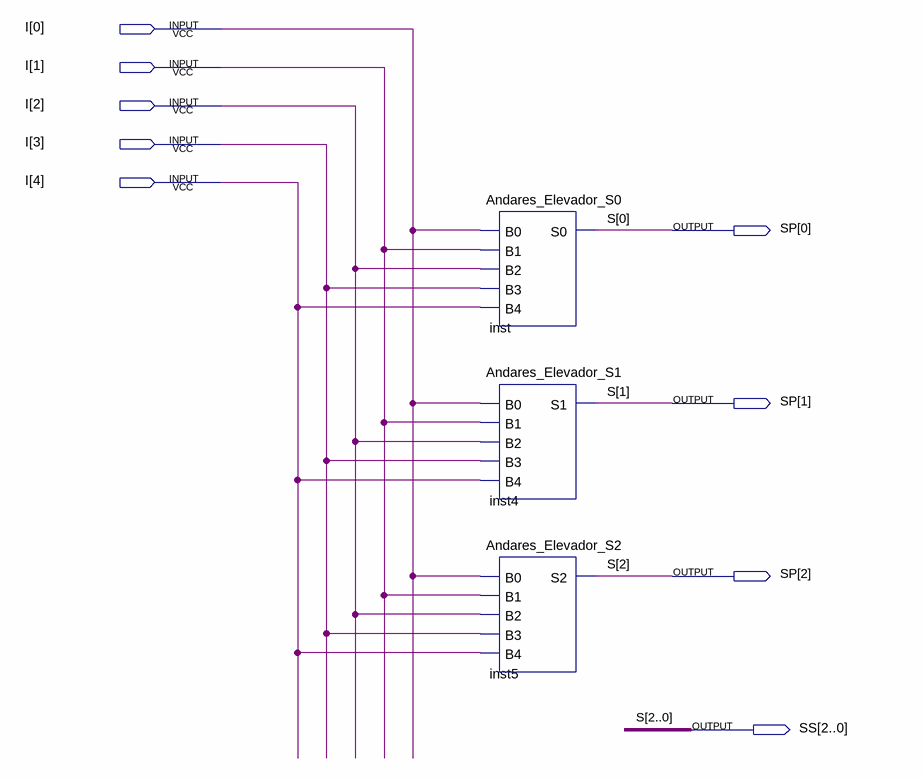
[diagram p0: schematic sheet]
// Quartus schematic Circuito_Combinacional_5_3bit.bdf as structural Verilog: 3 symbols, 9 pins
module Circuito_Combinacional_5_3bit (
  input  [4:0] I,
  output [2:0] SP,
  output [2:0] SS
);

  Andares_Elevador_S0 inst (.B0(I[0]), .B1(I[1]), .B2(I[2]), .B3(I[3]), .B4(I[4]), .S0(SP[0]));
  Andares_Elevador_S1 inst4 (.B0(I[0]), .B1(I[1]), .B2(I[2]), .B3(I[3]), .B4(I[4]), .S1(SP[1]));
  Andares_Elevador_S2 inst5 (.B0(I[0]), .B1(I[1]), .B2(I[2]), .B3(I[3]), .B4(I[4]), .S2(SP[2]));

  assign SS = SP;

  // Other names for the same wires on the sheet: S[2:0] = SP
endmodule
